# Altium schematic sheet DSO_IO.SchDoc: Schematic_Name
size A4; CompanyName: University of Melbourne; Engineer: Your Name Here; DocumentNumber: 1; Revision: 0.1; SheetNumber: 1; SheetTotal: 1; Title_Project: Project_Title; StudentNo: Student No.
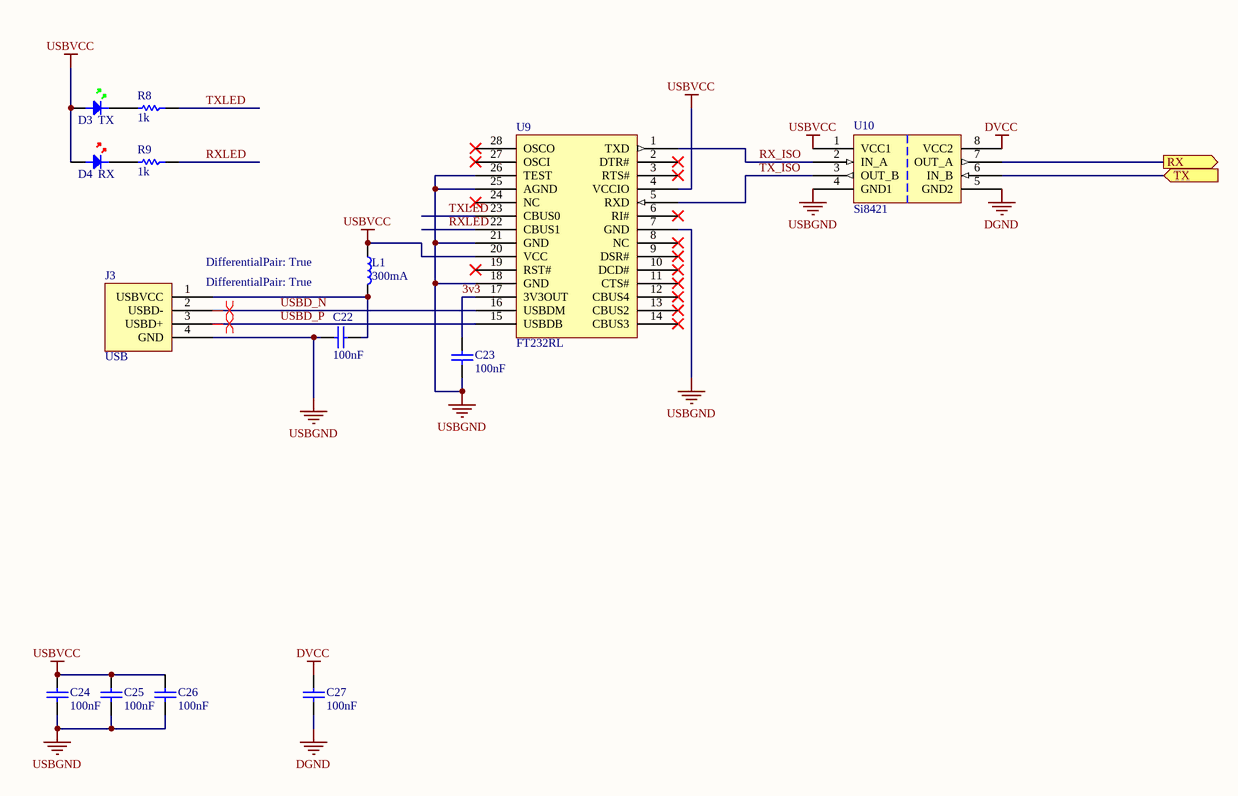
[diagram p0: DSO_IO.SchDoc]

## Parts
C22  100nF  [0805C]
C23  100nF  [0805C]
C24  100nF  [0805C]
C25  100nF  [0805C]
C26  100nF  [0805C]
C27  100nF  [0805C]
D3  TX  [0805D-GREEN]
D4  RX  [0805D-RED]
J3  USB  [USBPLUG]
L1  300mA  [0805]
R8  1k  [0805]
R9  1k  [0805]
U9  FT232RL  [SSOP-28]
U10  Si8421  [SOIC-8]

## Ports
RX (out), TX (in)

## Nets
DGND: C27.2 U10.5(GND2)
DVCC: C27.1 U10.8(VCC2)
USBGND: C22.2 C23.2 C24.2 C25.2 C26.2 J3.4(GND) U9.7(GND) U9.18(GND) U9.21(GND) U9.25(AGND) U9.26(TEST) U10.4(GND1)
USBVCC: C24.1 C25.1 C26.1 D3.A D4.A L1.1 U9.4(VCCIO) U9.20(VCC) U10.1(VCC1)
3v3: C23.1 U9.17(3V3OUT)
RX: U10.7(OUT_A) ; port RX
RX_ISO: U9.1(TXD) U10.2(IN_A)
RXLED: R9.1 U9.22(CBUS1)
TX: U10.6(IN_B) ; port TX
TX_ISO: U9.5(RXD) U10.3(OUT_B)
TXLED: R8.1 U9.23(CBUS0)
USBD_N: J3.2(USBD-) U9.16(USBDM)
USBD_P: J3.3(USBD+) U9.15(USBDB)
NetC22_1: C22.1 J3.1(USBVCC) L1.2
NetD3_K: D3.K R8.2
NetD4_K: D4.K R9.2

Not connected (* = marked no-connect by the designer): U9 2(DTR#)* 3(RTS#)* 6(RI#)* 8(NC)* 9(DSR#)* 10(DCD#)* 11(CTS#)* 12(CBUS4)* 13(CBUS2)* 14(CBUS3)* 19(RST#)* 24(NC)* 27(OSCI)* 28(OSCO)*

## Layout directives
differential pair: USBD_N, USBD_P

## Library data of the parts
C22-C27 = C: Capacitor; Reviewed by: RM - 2018/08/05; Revision: July-2002: Re-released for DXP Platform.; Value: 100nF; Supplier 1: *; Supplier Part Number 1: *
D3 = LED GREEN: Light Emitting Diode; Reviewed by: RM - 2018/08/05; Revision: July-2002: Re-released for DXP Platform.; Supplier 1: Digi-Key; Supplier Part Number 1: 160-1423-1-ND
D4 = LED RED: Light Emitting Diode; Reviewed by: RM - 2018/08/05; Revision: July-2002: Re-released for DXP Platform.; Supplier 1: Digi-Key; Supplier Part Number 1: 475-1415-1-ND
J3 = USBPLUG: USB B Type Connector; Reviewed by: RM - 2018/08/05; Supplier 1: Digi-Key; Supplier Part Number 1: 609-1039-ND
L1 = I: Inductor; Reviewed by: RM - 2018/08/05; Value: 300mA; Supplier 1: *; Supplier Part Number 1: *
R8 R9 = R: Resistor; Reviewed by: RM - 2018/08/05; Value: 1k; Supplier 1: *; Suppler Part Number 1: *
U9 = FT232RL: USB to Serial bridge; Reviewed by: RM - 2018/08/05; Supplier 1: Digi-Key; Supplier Part Number 1: 768-1007-1-ND
U10 = Si8421: Dual Channel Digital Isolator Both Ways; Reviewed by: RM - 2018/08/05; Supplier 1: Digi-Key; Supplier Part Number 1: 336-1755-5-ND